# Altium schematic sheet 04-CTRL1-ps2-blueretro.SchDoc
size A; SheetNumber: 5; SheetTotal: 6
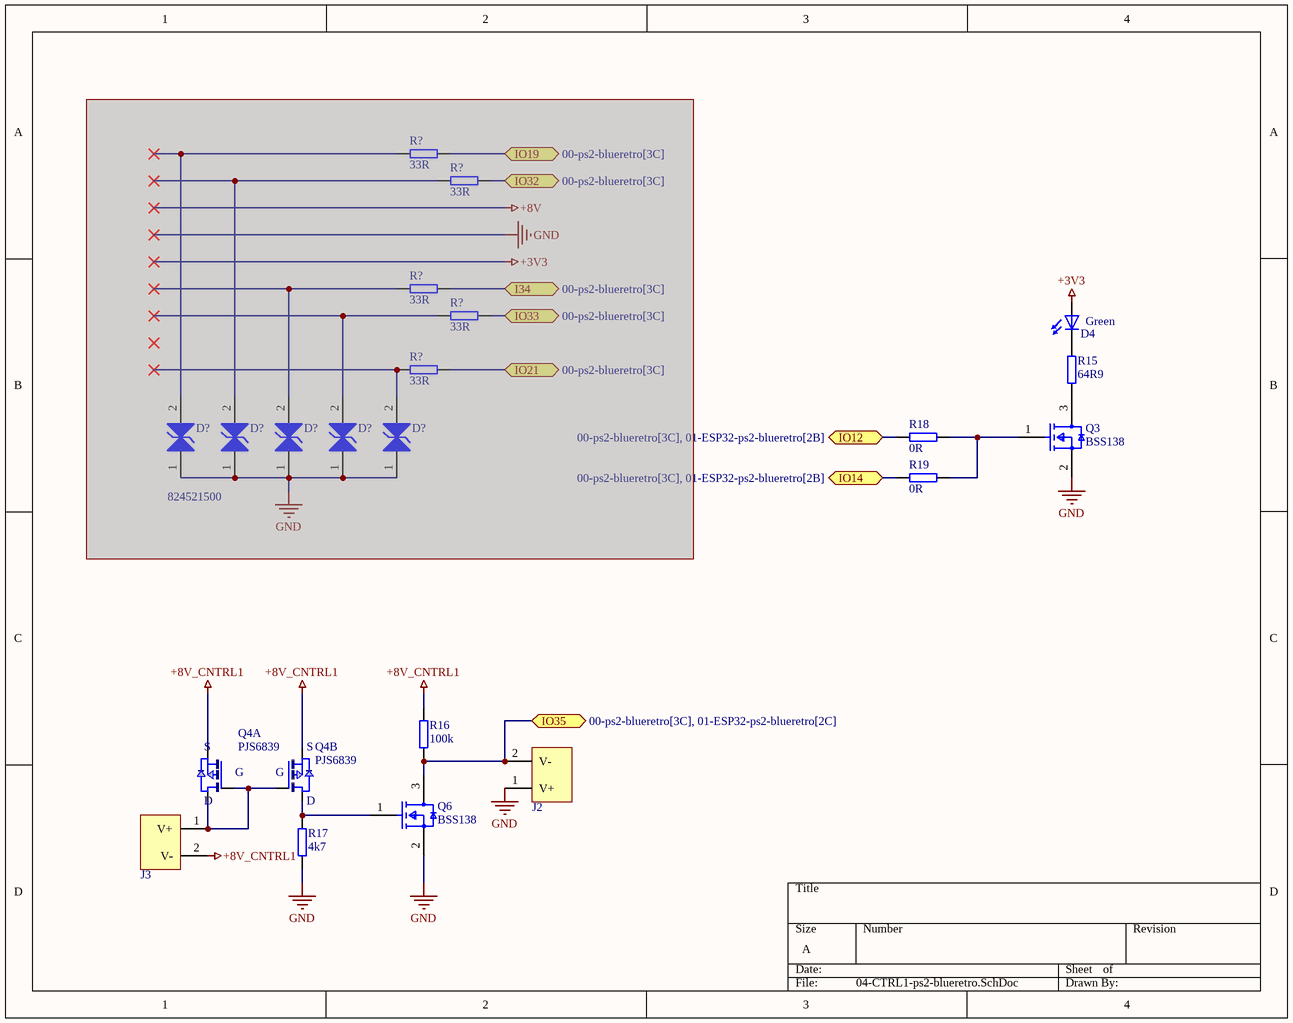
[diagram p0: 04-CTRL1-ps2-blueretro.SchDoc]

## Parts
(Parts that share a designator on the sheet are numbered #1, #2 ... from top to bottom, then left to right.)
D4  value Green  [led0603_GREEN]  (hidden comment: led_0603)
D?#1  824521500  [WE-TVSP_DO-214AA_Bidirectional]  (masked out: inside a compile mask, not in the netlist)
D?#2  824521500  [WE-TVSP_DO-214AA_Bidirectional]  (value not drawn)  (masked out: inside a compile mask, not in the netlist)
D?#3  824521500  [WE-TVSP_DO-214AA_Bidirectional]  (value not drawn)  (masked out: inside a compile mask, not in the netlist)
D?#4  824521500  [WE-TVSP_DO-214AA_Bidirectional]  (value not drawn)  (masked out: inside a compile mask, not in the netlist)
D?#5  824521500  [WE-TVSP_DO-214AA_Bidirectional]  (value not drawn)  (masked out: inside a compile mask, not in the netlist)
J2  2 Pole 2.54mm  [2.54mm_2pole]  (value not drawn)  (no BOM)
J3  2 Pole 2.54mm  [2.54mm_2pole]  (value not drawn)  (no BOM)
Q3  BSS138  [FP-318-08-IPC_B]
Q4  PJS6839  [SOT23-6]  (parts A,B of 2)
Q6  BSS138  [FP-318-08-IPC_B]
R15  value 64R9  [res_0603]  (hidden comment: res_0603)
R16  value 100k  [res_0603]  (hidden comment: res_0603)
R17  value 4k7  [res_0603]  (hidden comment: res_0603)
R18  value 0R  [res_0603]  (hidden comment: res_0603)
R19  value 0R  [res_0603]  (hidden comment: res_0603)
R?#1  value 33R  [res_0603]  (hidden comment: res_0603)  (masked out: inside a compile mask, not in the netlist)
R?#2  value 33R  [res_0603]  (hidden comment: res_0603)  (masked out: inside a compile mask, not in the netlist)
R?#3  value 33R  [res_0603]  (hidden comment: res_0603)  (masked out: inside a compile mask, not in the netlist)
R?#4  value 33R  [res_0603]  (hidden comment: res_0603)  (masked out: inside a compile mask, not in the netlist)
R?#5  value 33R  [res_0603]  (hidden comment: res_0603)  (masked out: inside a compile mask, not in the netlist)

## Ports
I34 (bidir, see 00-ps2-blueretro[3C]), IO12 (bidir, see 00-ps2-blueretro[3C], 01-ESP32-ps2-blueretro[2B]), IO14 (bidir, see 00-ps2-blueretro[3C], 01-ESP32-ps2-blueretro[2B]), IO19 (bidir, see 00-ps2-blueretro[3C]), IO21 (bidir, see 00-ps2-blueretro[3C]), IO32 (bidir, see 00-ps2-blueretro[3C]), IO33 (bidir, see 00-ps2-blueretro[3C]), IO35 (bidir, see 00-ps2-blueretro[3C], 01-ESP32-ps2-blueretro[2C])

## Nets
+3V3: D4.1(A)
+8V_CNTRL1: J3.2(V-) Q4.2(S2) Q4.5(S1) R16.2
GND: J2.1(V+) Q3.2(S) Q6.2(S) R17.1
IO12: R18.2 ; port IO12
IO14: R19.2 ; port IO14
IO35: J2.2(V-) Q6.3(D) R16.1 ; port IO35
NetD4_2: D4.2(C) R15.2
NetJ3_1: J3.1(V+) Q4.1(G1) Q4.3(G2) Q4.6(D1)
NetQ3_1: Q3.1(G) R18.1 R19.1
NetQ3_3: Q3.3(D) R15.1
NetQ4_4: Q4.4(D2) Q6.1(G) R17.2

## Notes on the sheet
- (in symbol PJS6839, part A) S; G; D
- (in symbol PJS6839, part B) S; G; D

## Library data of the parts
D4 = led_0603: Green 3,2V 20mA; Manufacturer: Würth Elektronik; Manufacturer Part Number: 150060GS75000; Supplier: Digikey; Price: 0,14; Supplier Part Number: 732-4971-1-ND; ComponentLink1Description: Supplier Link; ComponentLink1URL: https://www.digikey.at/de/products/detail/w%C3%BCrth-elektronik/150060GS75000/4489898; ComponentLink2Description: Manufacturer Link; ComponentLink2URL: *; ComponentLink3Description: Datasheet Link; ComponentLink3URL: https://www.we-online.com/components/products/datasheet/150060GS75000.pdf
D?#1-D?#5 = CMP-03913-71101632-1: 824521500 Tvs Diode, 600W, 5V, Bidir, DO-214AA; Leakage Current: 1.6mA; Clamping Voltage: 9.2V; Max Breakdown Voltage: 6.7V; Power Line Protection: No; Peak Pulse Current: 65.3A; Number of Bidirectional Channels: 1; Polarity: Bidirectional; Length: 4.32mm; Reverse Standoff Voltage: 5V; Number of Pins: 2; Peak Pulse Power: 600W; Height: 2.4mm; Width: 3.62mm; Min Operating Temperature: -65°C; REACH SVHC: Unknown; Breakdown Voltage: 6.7V; Min Breakdown Voltage: 6.7V; Max Operating Temperature: 150°C; Composition: Zener; Packaging: Cut Tape; NexarPartId: 71101632; Mount: Surface Mount; RoHS: Compliant
J2 J3 = 2 Pole 2.54mm: Solder contacts for a 2.54mm connector
Q3 Q6 = CMP-07173-000101-1: MOSFET N-CH 50V 220MA SOT-23; Turn-Off Delay Time: 20ns; Element Configuration: Single; Rds On Max: 3.5R; Gate to Source Voltage (Vgs): 20V; Threshold Voltage: 1.3V; Number of Elements: 1; Power Dissipation: 360mW; Rise Time: 9ns; Turn-On Delay Time: 2.5ns; Input Capacitance: 27pF; On-State Resistance: 6R; Lead Free: Lead Free; Length: 2.92mm; Width: 1.3mm; Drain to Source Breakdown Voltage: 50V; Min Operating Temperature: -55°C; REACH SVHC: No SVHC; Packaging: Tape and Reel; Radiation Hardening: No; Height: 0.93mm; Drain to Source Voltage (Vdss): 50V; Current Rating: 220mA; Voltage Rating (DC): 50V; Weight: 0.03g; Continuous Drain Current (ID): 220mA; Number of Pins: 3; Nominal Vgs: 1.3V; Max Power Dissipation: 360mW; Fall Time: 9ns; Drain to Source Resistance: 3.5R; Contact Plating: Tin; Case/Package: SOT-23; Package Quantity: 1; Dual Supply Voltage: 50V; Mount: Surface Mount; Termination: SMD/SMT; Max Operating Temperature: 150°C
Q4 = PJS6839: MOSFET P-CH 60V 300mA SOT-23-6; Manufacturer: Panjit International Inc.; Manufacturer Part Number: PJS6839_S1_00001; Supplier: Digikey; Supplier Part Number: 3757-PJS6839_S1_00001CT-ND; Price: 0.28; ComponentLink1Description: Datasheet; ComponentLink1URL: https://www.panjit.com.tw/upload/datasheet/PJS6839.pdf; ComponentLink2Description: Supplier; ComponentLink2URL: https://www.digikey.at/en/products/detail/panjit-international-inc/PJS6839-S1-00001/15799236; Value: PJS6839